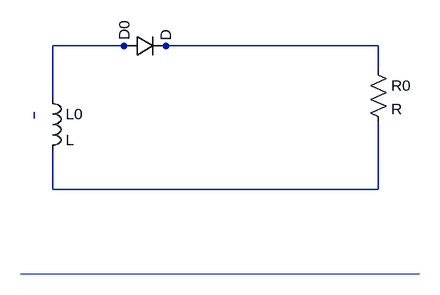
[diagram p0: schematic 2.asc]
2.asc, the LTspice schematic file:
Version 4
SHEET 1 880 680
WIRE 74 210 74 129
WIRE 74 290 74 350
WIRE 575 166 575 129
WIRE 575 246 575 350
WIRE 184 129 184 129
WIRE 248 129 248 129
WIRE 74 350 575 350
WIRE 46 231 46 241
WIRE 74 129 184 129
WIRE 248 129 575 129
WIRE 638 480 25 481
SYMBOL ind 58 194 R0
SYMATTR InstName L0
SYMBOL res 559 150 R0
SYMATTR InstName R0
SYMBOL diode 184 145 R270
SYMATTR InstName D0

The netlist it stands for:
* 2.asc
L0 N001 N002 L
R0 N003 N002 R
D0 N001 N003 D
.model D D
.lib standard.dio
.backanno
.end